# Altium schematic sheet LCD_BT.SchDoc
size A3; SheetNumber: 3; SheetTotal: 4
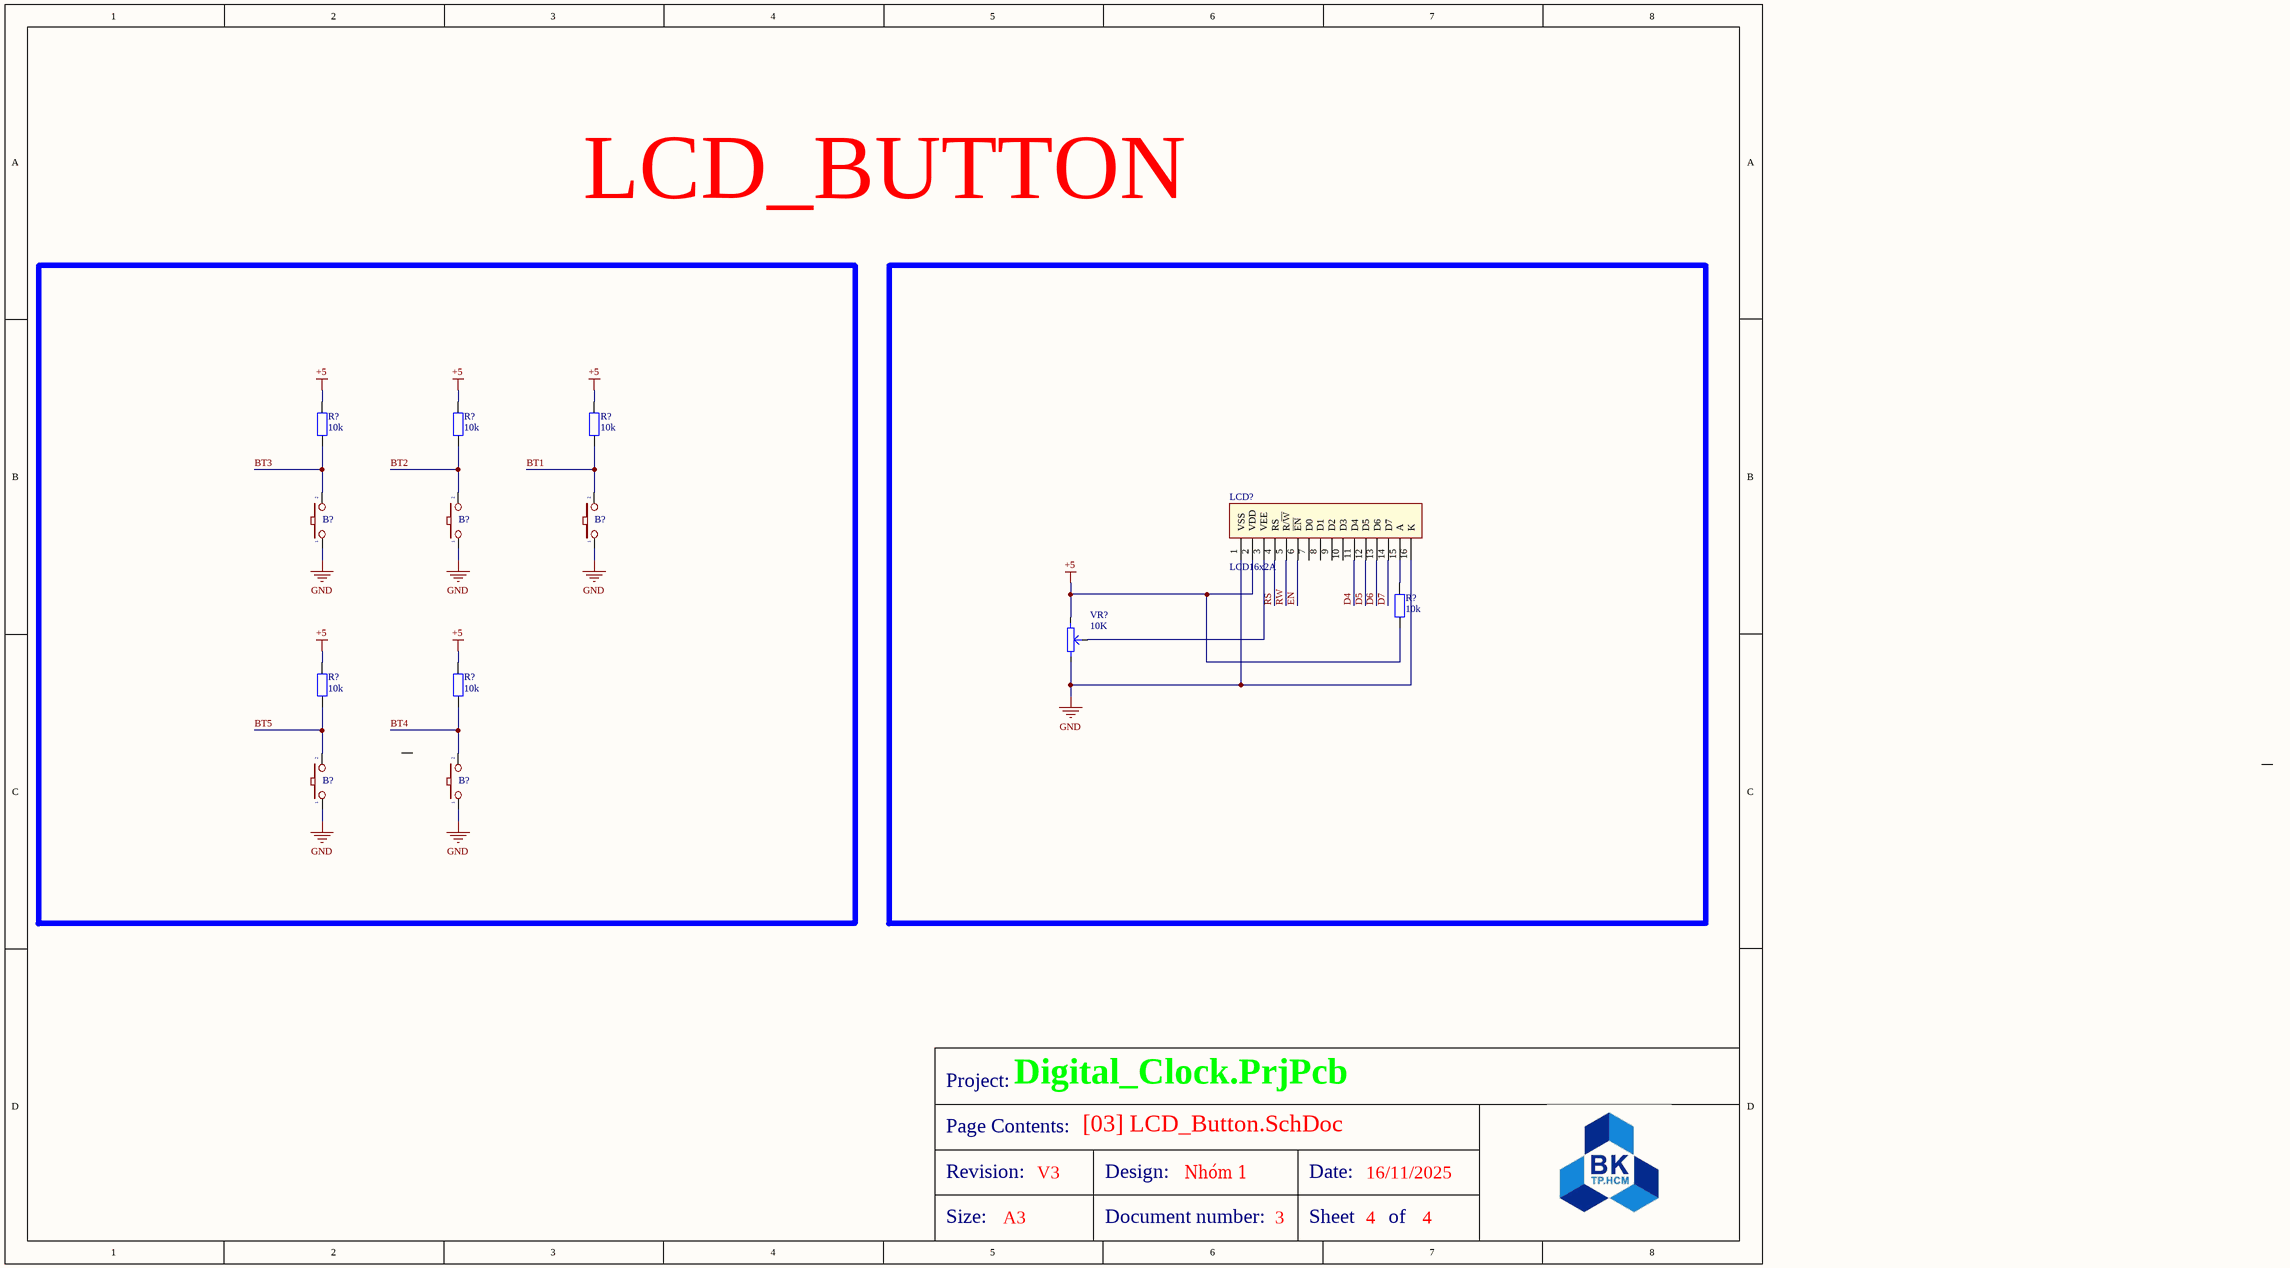
[diagram p0: LCD_BT.SchDoc]

## Parts
(Parts that share a designator on the sheet are numbered #1, #2 ... from top to bottom, then left to right.)
B?#1  (no value)  [SW2]
B?#2  (no value)  [SW2]
B?#3  (no value)  [SW2]
B?#4  (no value)  [SW2]
B?#5  (no value)  [SW2]
LCD?  LCD16x2A  [LCD16X2]
R?#1  10k  [tro smd 0603]
R?#2  10k  [tro smd 0603]
R?#3  10k  [tro smd 0603]
R?#4  10k  [tro smd 0603]
R?#5  10k  [tro smd 0603]
R?#6  10k  [tro smd 0603]
VR?  10K  [Bien Tro Tam Giac Dung]

## Nets
+5: LCD?.2(VDD) R?#1.1 R?#2.1 R?#3.1 R?#4.1 R?#5.1 R?#6.1 VR?.1
GND: B?#1.1 B?#2.1 B?#3.1 B?#4.1 B?#5.1 LCD?.1(VSS) LCD?.16(K) VR?.3
BT1: B?#3.2 R?#3.2
BT2: B?#2.2 R?#2.2
BT3: B?#1.2 R?#1.2
BT4: B?#5.2 R?#6.2
BT5: B?#4.2 R?#5.2
D4: LCD?.11(D4)
D5: LCD?.12(D5)
D6: LCD?.13(D6)
D7: LCD?.14(D7)
EN: LCD?.6(~{EN})
RS: LCD?.4(RS)
RW: LCD?.5(R/~{W})
NetLCD?_3: LCD?.3(VEE) VR?.2
NetLCD?_15: LCD?.15(A) R?#4.2

Not connected (* = marked no-connect by the designer): LCD? 7(D0) 8(D1) 9(D2) 10(D3)

## Notes on the sheet
- LCD_BUTTON
- Project:
- Digital_Clock.PrjPcb
- Page Contents:
- [03] LCD_Button.SchDoc
- Revision:
- Size:
- A3
- V3
- Design:
- Document number:
- Nhóm 1
- 3
- Date:
- Sheet
- 16/11/2025
- 4
- of

## Library data of the parts
B?#1-B?#5 = SW2: Switch button 2 pin; Value: SW chip 2 pin
LCD? = LCD16x2: LCD dipslay 16 char, 2 line; Value: LCD16x2A
R?#1-R?#6 = Tro 0603 5% 10k: Dán; Don_Vi: Con; So_Chan: 2; Ten_Linh_Kien: Trở 0603 5% 10k; Ma_Hang: MH006316; Chung_Loai: Dán; Kieu_Chan: *
VR? = Bien tro tam giac 10K Dung: Cắm; Ma_Hang: MH000919; Don_Vi: Con; Ten_Linh_Kien: Biến Trở Tam Giác 103-10K RM065 (Chân Đứng); Chung_Loai: Cắm; Kieu_Chan: *